# Altium schematic sheet passeBas.SchDoc
size A4; SheetNumber: 2; SheetTotal: 2
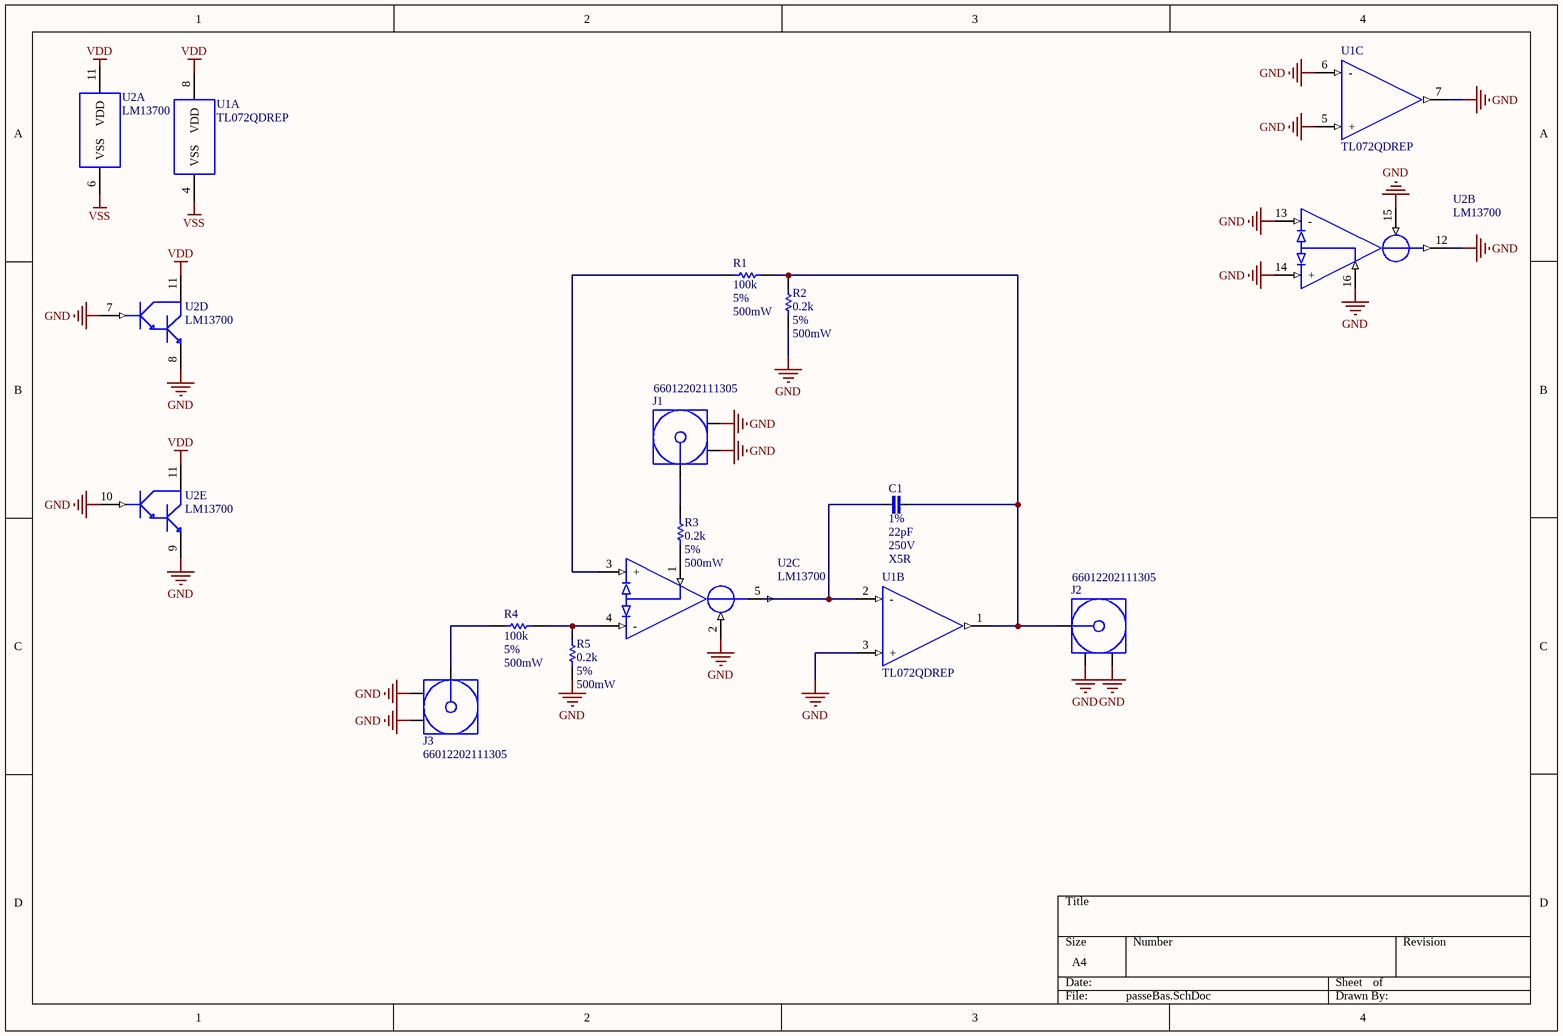
[diagram p0: passeBas.SchDoc]

## Parts
C1  value 22pF  Tol: 1%  Tension: 250V  Tech: X5R  [0805]  (hidden comment: Capacitor_22pF_250V_1%_X5R_0805)
J1  Ref: 66012202111305  [MMCX_66012202111305]  (hidden comment: MMCX_66012202111305)
J2  Ref: 66012202111305  [MMCX_66012202111305]  (hidden comment: MMCX_66012202111305)
J3  Ref: 66012202111305  [MMCX_66012202111305]  (hidden comment: MMCX_66012202111305)
R1  value 100k  Tol: 5%  Power: 500mW  [0805_RES]  (hidden comment: Resistor_100k_5%_500mW_0805)
R2  value 0.2k  Tol: 5%  Power: 500mW  [0805_RES]  (hidden comment: Resistor_0.2k_5%_500mW_0805)
R3  value 0.2k  Tol: 5%  Power: 500mW  [0805_RES]  (hidden comment: Resistor_56k_5%_500mW_0805)
R4  value 100k  Tol: 5%  Power: 500mW  [0805_RES]  (hidden comment: Resistor_100k_5%_500mW_0805)
R5  value 0.2k  Tol: 5%  Power: 500mW  [0805_RES]  (hidden comment: Resistor_0.2k_5%_500mW_0805)
U1  Ref: TL072QDREP  [SOIC8]  (hidden comment: AOP_TL072QDREP)  (parts A,B,C of 3)
U2  LM13700  [SOIC16L]  (parts A,B,C,D,E of 5)

## Nets
GND: J1.2(GND) J1.3(GND) J2.2(GND) J2.3(GND) J3.2(GND) J3.3(GND) R2.1 R5.1 U1.3(+) U1.5(+) U1.6(-) U1.7(outB) U2.2 U2.7 U2.8 U2.9 U2.10 U2.12(outA) U2.13(-) U2.14(+) U2.15 U2.16
VDD: U1.8(VDD) U2.11(VDD)
VSS: U1.4(VSS) U2.6(VSS)
NetC1_1: C1.1 U1.2(-)
NetC1_2: C1.2 J2.1(Signal) R1.2 R2.2 U1.1(outA)
NetJ1_1: J1.1(Signal) R3.2
NetJ3_1: J3.1(Signal) R4.2
NetR1_1: R1.1 U2.3(+)
NetR3_1: R3.1 U2.1
NetR4_1: R4.1 R5.2 U2.4(-)

Not connected (* = marked no-connect by the designer): U2 5

## Notes on the sheet
- Labels drawn without touching a wire or pin: VDD

## Library data of the parts
C1 = Capacitor_22pF_250V_1%_X5R_0805: Capacitor 22pF 250V 10% X5R 0805; Constructor: KEMET; Type: Passive; Ref: C0805C104K1RACTU; Supplier 1: Mouser; Supplier Part Number 1: 81-GRM21A5C2E220FW1D
J1-J3 = MMCX_66012202111305: Connecteur MMCX  horizontal SMD; Constructor: Wurth; Type: Connector
R1 R4 = Resistor_100k_5%_500mW_0805: Resistor  100k 5% 500mW 0805; Constructor: Panasonic; Ref: CRCW080510K0FKEA; Voltage: 150V; Type: Vishay; Supplier 1: Digi-Key; Supplier Part Number 1: 511-SDR10EZPD1003CT-ND
R2 R5 = Resistor_0.2k_5%_500mW_0805: Resistor  0.2k 5% 500mW 0805; Constructor: Panasonic; Ref: CRCW080510K0FKEA; Voltage: 150V; Type: Vishay; Supplier 1: Digi-Key; Supplier Part Number 1: 511-SDR10EZPJ200CT-ND
R3 = Resistor_56k_5%_500mW_0805: Resistor  56k 5% 500mW 0805; Constructor: Panasonic; Ref: CRCW080510K0FKEA; Voltage: 150V; Type: Vishay; Supplier 1: Digi-Key; Supplier Part Number 1: 511-SDR10EZPJ563CT-ND
U1 = AOP_TL072QDREP: low noise Jfet input amplifier; Constructor: Texas Instruments; Type: Semiconductors
U2 = OTA_LM13700: OTA; Constructor: Texas Instruments; Type: Semiconductors; Ref: LM13700